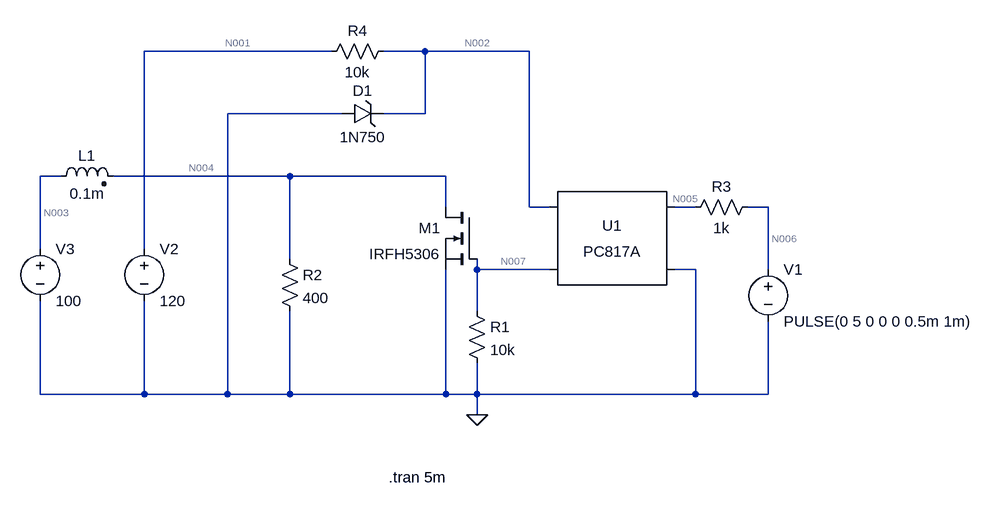
[diagram p0: schematic Speed_Controller.asc]
Speed_Controller.asc, the LTspice schematic file:
Version 4
SHEET 1 1004 680
WIRE 0 -256 -288 -256
WIRE 144 -256 80 -256
WIRE 304 -256 144 -256
WIRE 16 -160 -160 -160
WIRE 144 -160 144 -256
WIRE 144 -160 80 -160
WIRE -416 -64 -448 -64
WIRE -64 -64 -336 -64
WIRE 176 -64 -64 -64
WIRE 176 -16 176 -64
WIRE 304 -16 304 -256
WIRE 336 -16 304 -16
WIRE 560 -16 528 -16
WIRE 672 -16 640 -16
WIRE -448 48 -448 -64
WIRE -288 48 -288 -256
WIRE -64 64 -64 -64
WIRE 224 80 224 64
WIRE 336 80 224 80
WIRE 560 80 528 80
WIRE 672 80 672 -16
WIRE 224 144 224 80
WIRE -448 272 -448 128
WIRE -288 272 -288 128
WIRE -288 272 -448 272
WIRE -160 272 -160 -160
WIRE -160 272 -288 272
WIRE -64 272 -64 144
WIRE -64 272 -160 272
WIRE 176 272 176 80
WIRE 176 272 -64 272
WIRE 224 272 224 224
WIRE 224 272 176 272
WIRE 560 272 560 80
WIRE 560 272 224 272
WIRE 672 272 672 160
WIRE 672 272 560 272
WIRE 224 304 224 272
FLAG 224 304 0
SYMBOL nmos 224 -16 M0
SYMATTR InstName M1
SYMATTR Value IRFH5306
SYMBOL res 208 128 R0
SYMATTR InstName R1
SYMATTR Value 10k
SYMBOL res -80 48 R0
SYMATTR InstName R2
SYMATTR Value 400
SYMBOL Optos\\PC817A 432 32 M0
SYMATTR InstName U1
SYMBOL voltage 672 64 R0
WINDOW 123 0 0 Left 0
WINDOW 39 0 0 Left 0
SYMATTR InstName V1
SYMATTR Value PULSE(0 5 0 0 0 0.5m 1m)
SYMBOL res 656 -32 R90
WINDOW 0 0 56 VBottom 2
WINDOW 3 32 56 VTop 2
SYMATTR InstName R3
SYMATTR Value 1k
SYMBOL voltage -288 32 R0
WINDOW 123 0 0 Left 0
WINDOW 39 0 0 Left 0
SYMATTR InstName V2
SYMATTR Value 120
SYMBOL res 96 -272 R90
WINDOW 0 0 56 VBottom 2
WINDOW 3 32 56 VTop 2
SYMATTR InstName R4
SYMATTR Value 10k
SYMBOL zener 16 -144 R270
WINDOW 0 36 32 VTop 2
WINDOW 3 -4 32 VBottom 2
SYMATTR InstName D1
SYMATTR Value 1N750
SYMBOL voltage -448 32 R0
WINDOW 123 0 0 Left 0
WINDOW 39 0 0 Left 0
SYMATTR InstName V3
SYMATTR Value 100
SYMBOL ind2 -432 -48 R270
WINDOW 0 32 56 VTop 2
WINDOW 3 5 56 VBottom 2
SYMATTR InstName L1
SYMATTR Value 0.1m
SYMATTR SpiceLine Rser=30
SYMATTR Type ind
TEXT 88 400 Left 2 !.tran 5m

The netlist it stands for:
* Speed_Controller.asc
M1 N004 N007 0 0 IRFH5306
R1 N007 0 10k
R2 N004 0 400
XU1 N005 0 N002 N007 PC817 Igain=1m
V1 N006 0 PULSE(0 5 0 0 0 0.5m 1m)
R3 N006 N005 1k
V2 N001 0 120
R4 N002 N001 10k
D1 0 N002 1N750
V3 N003 0 100
L1 N003 N004 0.1m Rser=30
.model D D
.lib standard.dio
.model NMOS NMOS
.model PMOS PMOS
.lib standard.mos
.tran 5m
.lib PC817.sub
.backanno
.end

* Results of the author's LTspice run, read from the files saved beside the schematic
* Operating Point, zero values left out:
*   V(n004) = 93.02 V
*   V(n007) = 142.9 nV
*   V(n002) = 4.671 V
*   V(n001) = 120 V
*   V(n003) = 100 V
*   Id(M1) = 393.8 pA
*   Is(M1) = -393.8 pA
*   I(D1) = -11.53 mA
*   I(L1) = 232.6 mA
*   I(R4) = -11.53 mA
*   I(R2) = 232.6 mA
*   I(R1) = 14.29 pA
*   I(V3) = -232.6 mA
*   I(V2) = -11.53 mA
*   Ix(u1:3) = 14.29 pA
*   Ix(u1:4) = -14.29 pA
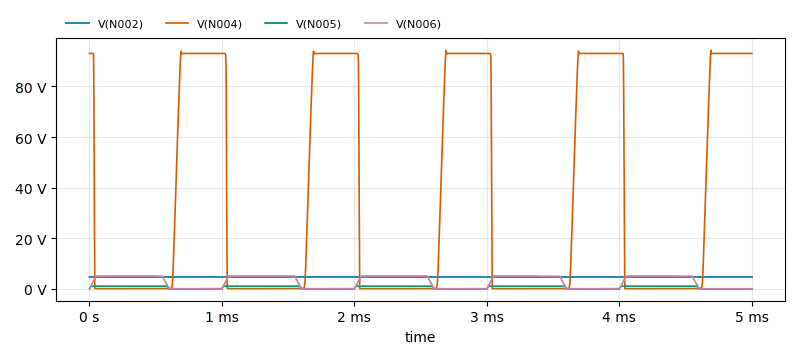
[diagram p1: Transient Analysis of Speed_Controller.asc, plotted from the saved traces]
* Transient Analysis, 1 run:
*   V(N002): min 4.655 V, max 4.671 V, average 4.669 V, rms 4.669 V, last 4.671 V
*   V(N004): min 61.01 mV, max 94.24 V, average 35.27 V, rms 56.37 V, last 93.02 V
*   V(N005): min -394.6 nV, max 1.056 V, average 619.8 mV, rms 805 mV, last 0 V
*   V(N006): min 0 V, max 5 V, average 2.75 V, rms 3.652 V, last 0 V